# EAGLE design Front panel PCB (EAGLE 5.12)
AUTHORNAME: Aaron Bonnell-Kangas; BOARDNAME: Balancer Front Panel; BOM: EXCLUDE; DATABASE: ../../../../../Component libraries/partsdb.txt; DESC: CAN HEADER; FUNCTION: BALANCER BOARD COMM; PARTNO: BCX38C; QTY: 2; REVISIONDATE: v1.0 - 2016-01-xx

## Sheet 1 of 5
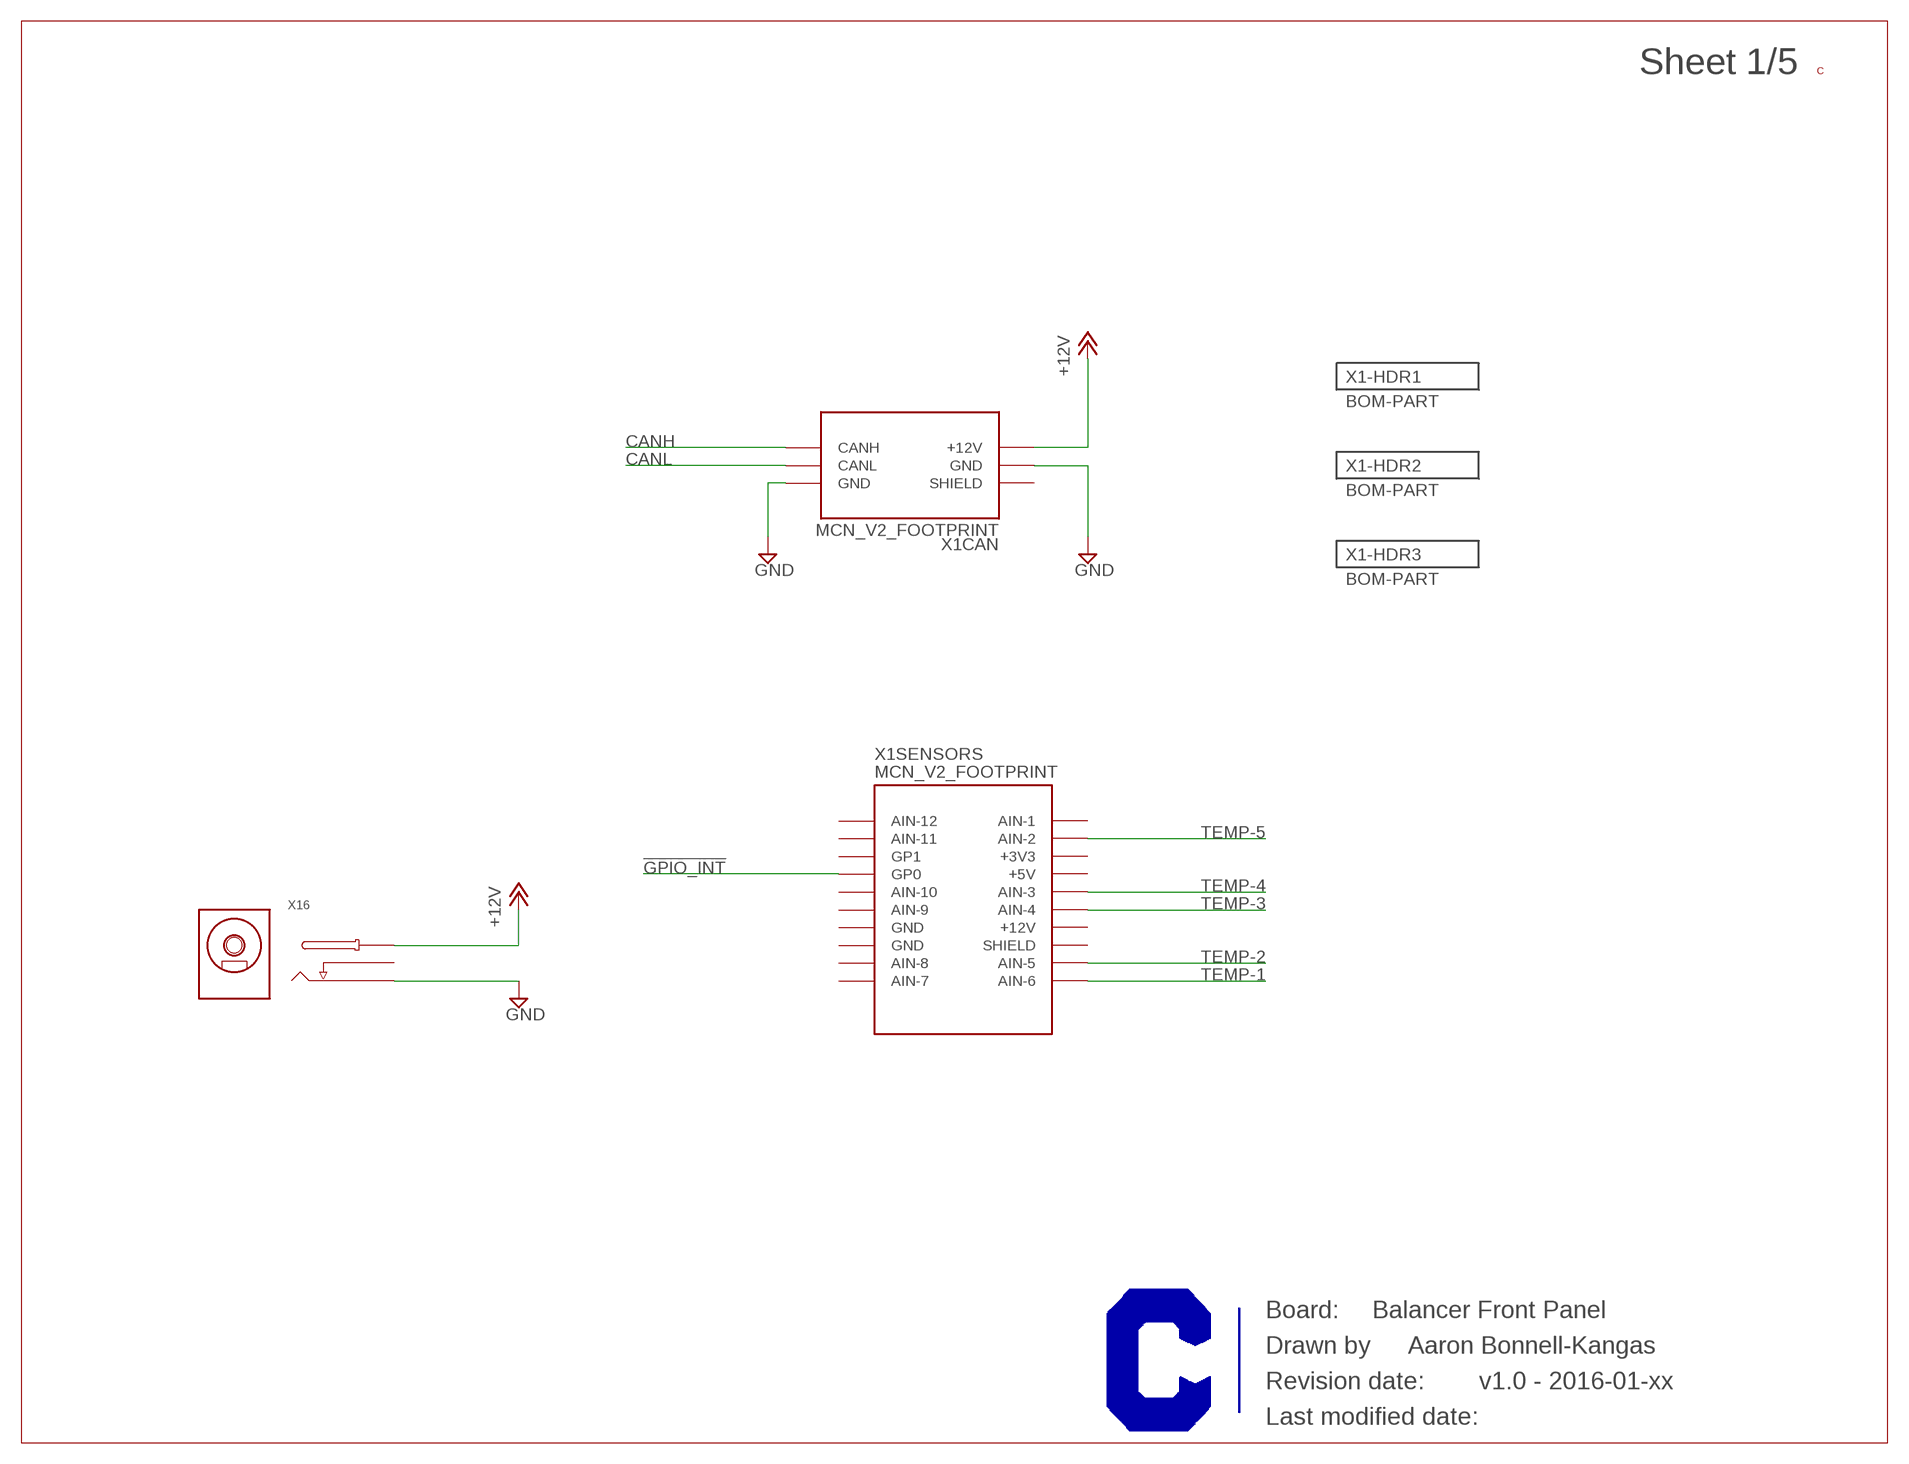
[diagram p0: schematic, sheet 1]
X1-HDR1 (BOM-PART): BOM: INCLUDE; QTY: 1
X1-HDR2 (BOM-PART): BOM: INCLUDE; QTY: 1
X1-HDR3 (BOM-PART): BOM: INCLUDE; QTY: 1

### Parts
U$6  CURRENT-LOGO-0.25"  [CURRENT-0.25"]
X1  MCN_V2_FOOTPRINT  [MCN_V2_FOOTPRINT]
X16  BARREL_JACK-NO_CUTOUTS  [BARREL_JACK_5.5X2.1_NO-CUTOUTS]

### Nets
!GPIO_INT: X1.SENSORS-7(SENSORS:GP0) ; also sheet 2
+12V: X1.CAN-5(CAN:+12V) X16.1(TIP) ; also sheet 3,5
CANH: X1.CAN-6(CAN:CANH) ; also sheet 3
CANL: X1.CAN-4(CAN:CANL) ; also sheet 3
GND: X1.CAN-2(CAN:GND) X1.CAN-3(CAN:GND) X16.2(SLEEVE) ; also sheet 2,3,4,5
TEMP-1: X1.SENSORS-12(SENSORS:AIN-6) ; also sheet 5
TEMP-2: X1.SENSORS-11(SENSORS:AIN-5) ; also sheet 5
TEMP-3: X1.SENSORS-15(SENSORS:AIN-4) ; also sheet 5
TEMP-4: X1.SENSORS-16(SENSORS:AIN-3) ; also sheet 5
TEMP-5: X1.SENSORS-19(SENSORS:AIN-2) ; also sheet 5
Unconnected: X1.CAN-1(CAN:SHIELD) X1.SENSORS-1(SENSORS:AIN-7) X1.SENSORS-2(SENSORS:AIN-8) X1.SENSORS-3(SENSORS:GND) X1.SENSORS-4(SENSORS:GND) X1.SENSORS-5(SENSORS:AIN-9) X1.SENSORS-6(SENSORS:AIN-10) X1.SENSORS-8(SENSORS:GP1) X1.SENSORS-9(SENSORS:AIN-11) X1.SENSORS-10(SENSORS:AIN-12) X1.SENSORS-13(SENSORS:SHIELD) X1.SENSORS-14(SENSORS:+12V) X1.SENSORS-17(SENSORS:+5V) X1.SENSORS-18(SENSORS:+3V3) X1.SENSORS-20(SENSORS:AIN-1) X16.3(BREAK)

## Sheet 2 of 5
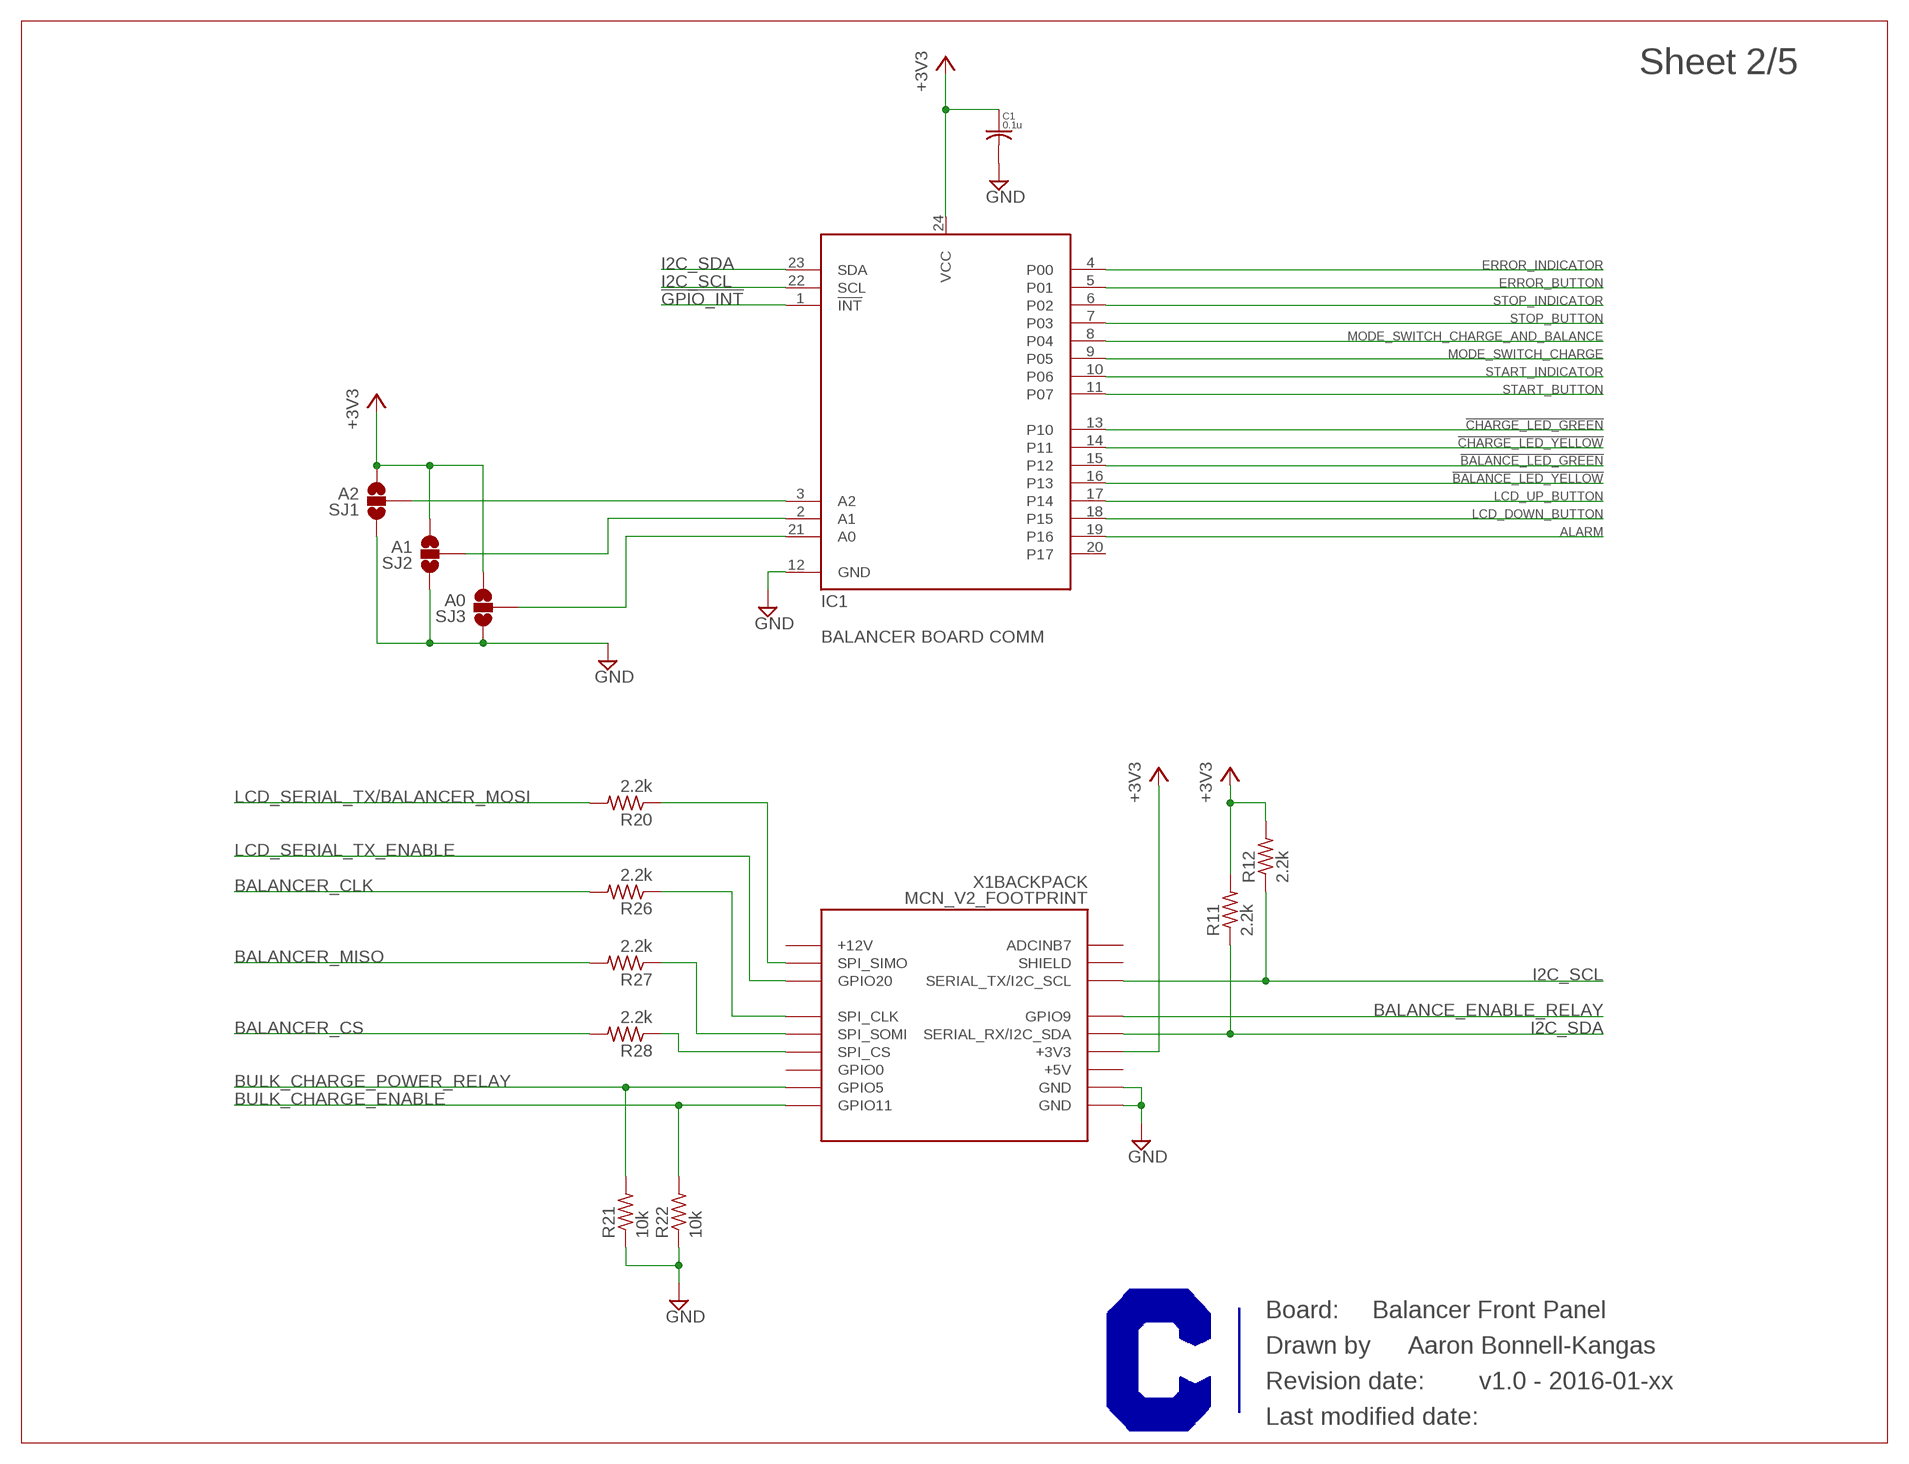
[diagram p1: schematic, sheet 2]

### Parts
C1  0.1u  C-USC0603  [C0603]
IC1  TCA9555PWR  [PW_(R-PDSO-G24)_(TSSOP-24)]
R11  2.2k  R-US_R0603  [R0603]
R12  2.2k  R-US_R0603  [R0603]
R20  2.2k  R-US_R0603  [R0603]
R21  10k  R-US_R0603  [R0603]
R22  10k  R-US_R0603  [R0603]
R26  2.2k  R-US_R0603  [R0603]
R27  2.2k  R-US_R0603  [R0603]
R28  2.2k  R-US_R0603  [R0603]
SJ1  A2  SOLDERJUMPER_2WAYPASTE1&2  [SJ_3_PASTE1&2]
SJ2  A1  SOLDERJUMPER_2WAYPASTE1&2  [SJ_3_PASTE1&2]
SJ3  A0  SOLDERJUMPER_2WAYPASTE1&2  [SJ_3_PASTE1&2]

### Nets
!BALANCE_LED_GREEN: IC1.15(P12) ; also sheet 4
!BALANCE_LED_YELLOW: IC1.16(P13) ; also sheet 4
!CHARGE_LED_GREEN: IC1.13(P10) ; also sheet 4
!CHARGE_LED_YELLOW: IC1.14(P11) ; also sheet 4
!GPIO_INT: IC1.1(!INT) ; also sheet 1
+3V3: C1.1 IC1.24(VCC) R11.2 R12.2 SJ1.3 SJ2.3 SJ3.3 X1.X1-7(BACKPACK:+3V3) ; also sheet 3,4,5
ALARM: IC1.19(P16) ; also sheet 5
BALANCE_ENABLE_RELAY: X1.X1-5(BACKPACK:GPIO9) ; also sheet 3
BALANCER_CLK: R26.2 ; also sheet 4
BALANCER_CS: R28.2 ; also sheet 4
BALANCER_MISO: R27.2 ; also sheet 4
BULK_CHARGE_ENABLE: R22.2 X1.X2-10(BACKPACK:GPIO11) ; also sheet 4
BULK_CHARGE_POWER_RELAY: R21.2 X1.X2-9(BACKPACK:GPIO5) ; also sheet 4
ERROR_BUTTON: IC1.5(P01) ; also sheet 3
ERROR_INDICATOR: IC1.4(P00) ; also sheet 3
GND: C1.2 IC1.12(GND) R21.1 R22.1 SJ1.1 SJ2.1 SJ3.1 X1.X1-9(BACKPACK:GND) X1.X1-10(BACKPACK:GND) ; also sheet 1,3,4,5
I2C_SCL: IC1.22(SCL) R12.1 X1.X1-3(BACKPACK:SERIAL_TX/I2C_SCL) ; also sheet 4
I2C_SDA: IC1.23(SDA) R11.1 X1.X1-6(BACKPACK:SERIAL_RX/I2C_SDA) ; also sheet 4
LCD_DOWN_BUTTON: IC1.18(P15) ; also sheet 4
LCD_SERIAL_TX/BALANCER_MOSI: R20.2 ; also sheet 4
LCD_SERIAL_TX_ENABLE: X1.X2-3(BACKPACK:GPIO20) ; also sheet 4
LCD_UP_BUTTON: IC1.17(P14) ; also sheet 4
MODE_SWITCH_CHARGE: IC1.9(P05) ; also sheet 3
MODE_SWITCH_CHARGE_AND_BALANCE: IC1.8(P04) ; also sheet 3
N$8: R20.1 X1.X2-2(BACKPACK:SPI_SIMO)
N$9: IC1.3(A2) SJ1.2
N$11: IC1.2(A1) SJ2.2
N$12: IC1.21(A0) SJ3.2
N$14: R26.1 X1.X2-5(BACKPACK:SPI_CLK)
N$17: R27.1 X1.X2-6(BACKPACK:SPI_SOMI)
N$18: R28.1 X1.X2-7(BACKPACK:SPI_CS)
START_BUTTON: IC1.11(P07) ; also sheet 3
START_INDICATOR: IC1.10(P06) ; also sheet 3
STOP_BUTTON: IC1.7(P03) ; also sheet 3
STOP_INDICATOR: IC1.6(P02) ; also sheet 3
Unconnected: IC1.20(P17) X1.X1-1(BACKPACK:ADCINB7) X1.X1-2(BACKPACK:SHIELD) X1.X1-8(BACKPACK:+5V) X1.X2-1(BACKPACK:+12V) X1.X2-8(BACKPACK:GPIO0)

## Sheet 3 of 5
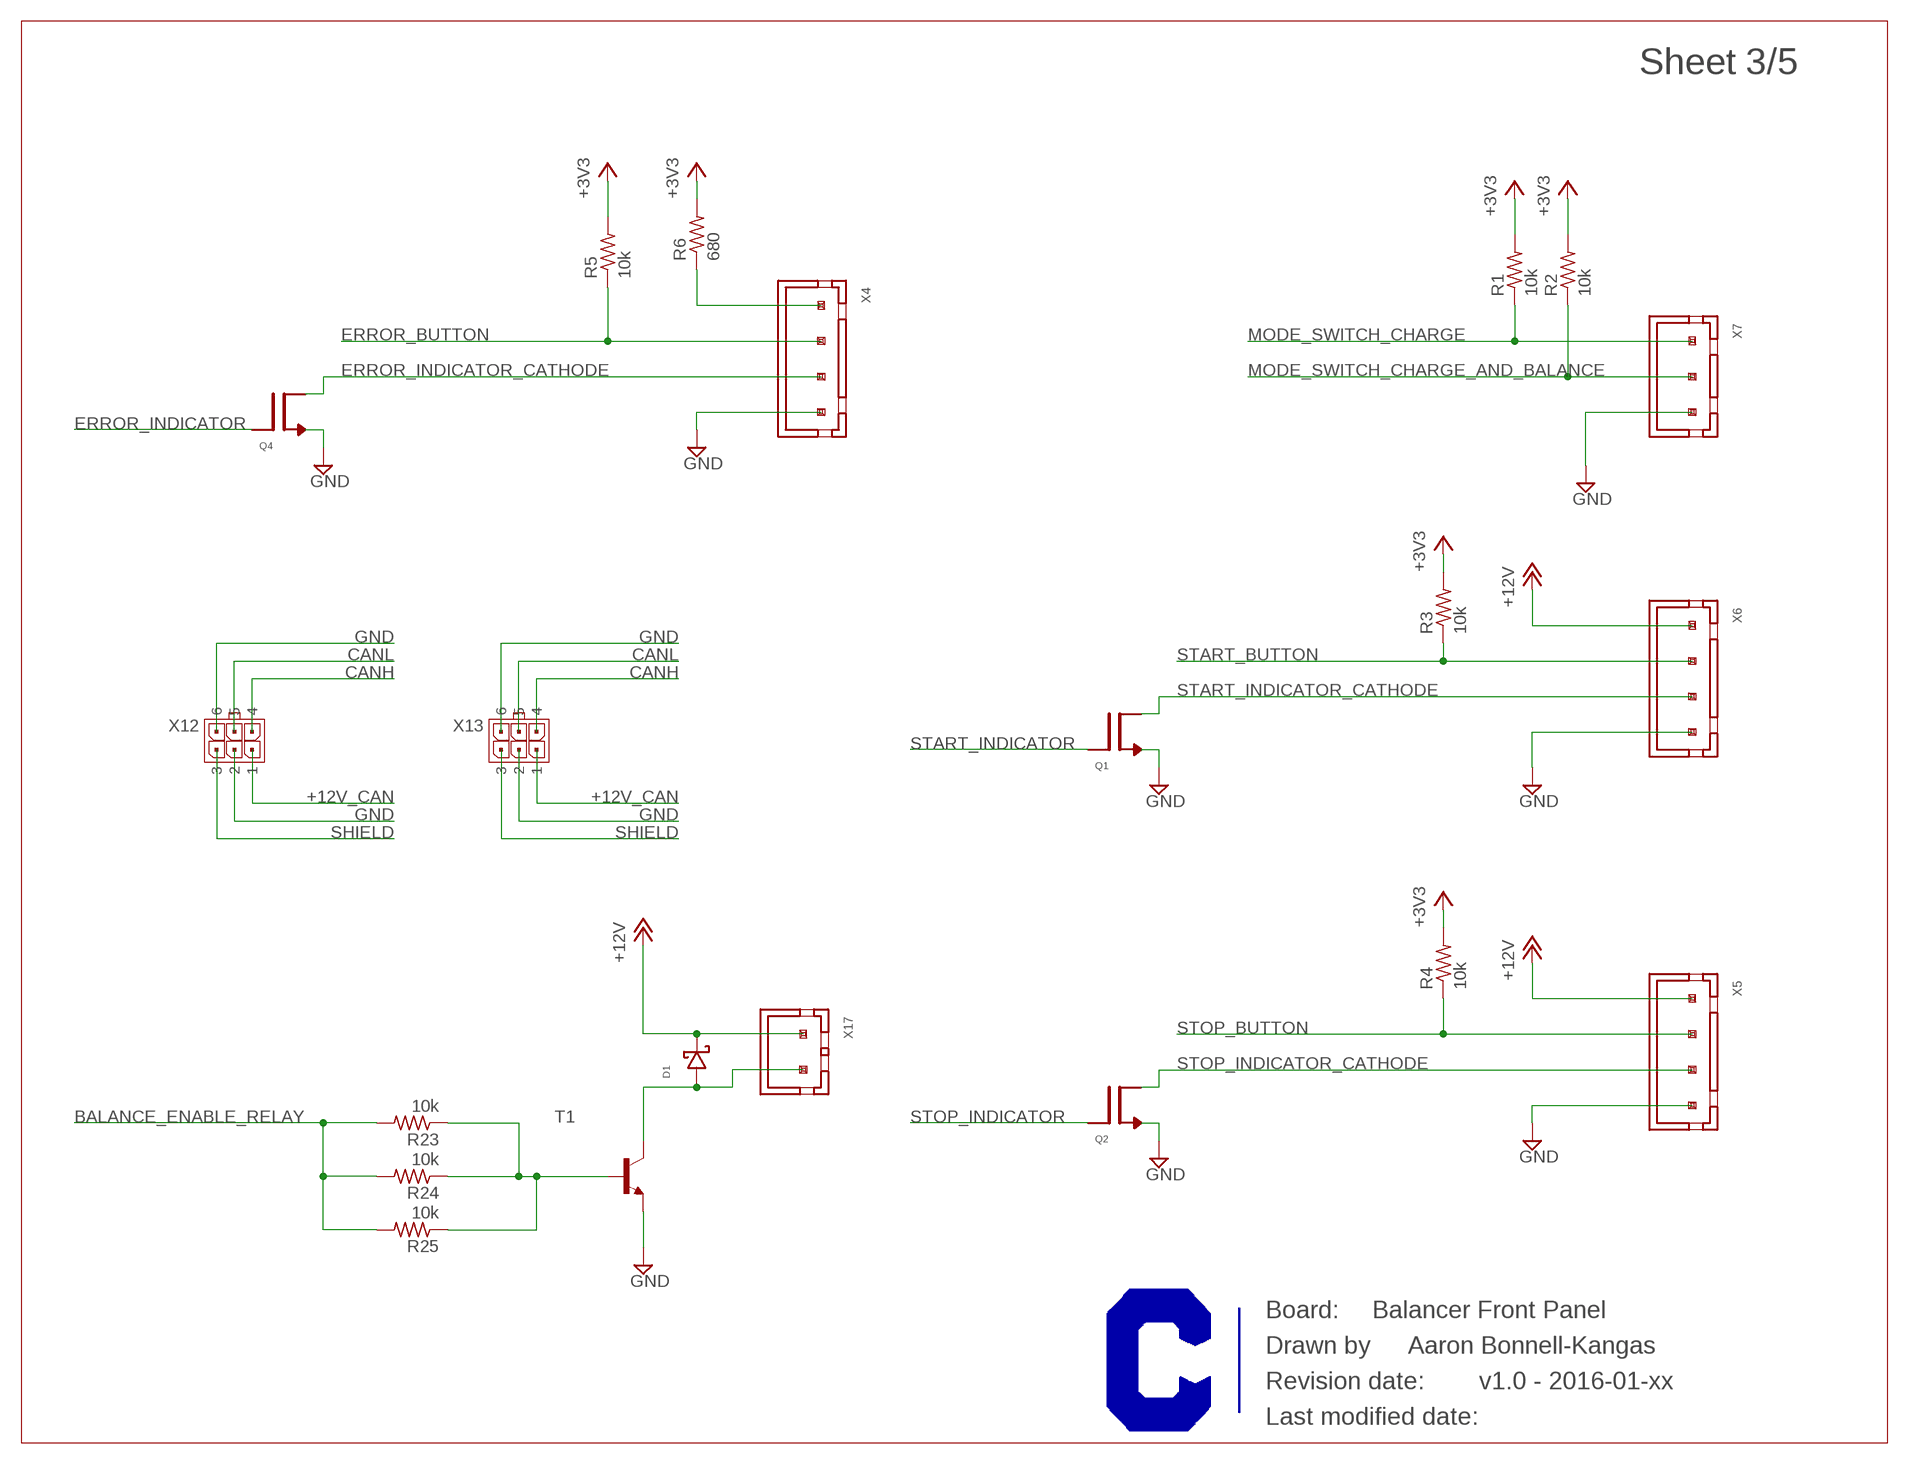
[diagram p2: schematic, sheet 3]

### Parts
D1  SCHOTTKY_DIODE-SMA  [SMA]
Q1  FDN359AN  [SOT-23]
Q2  FDN359AN  [SOT-23]
Q4  FDN359AN  [SOT-23]
R1  10k  R-US_R0603  [R0603]
R2  10k  R-US_R0603  [R0603]
R3  10k  R-US_R0603  [R0603]
R4  10k  R-US_R0603  [R0603]
R5  10k  R-US_R0603  [R0603]
R6  680  R-US_R1210  [R1210]
R23  10k  R-US_R0603  [R0603]
R24  10k  R-US_R0603  [R0603]
R25  10k  R-US_R0603  [R0603]
T1  MPS2222A-NPN-TO92-CBE  [TO92-CBE]
X4  XH-4CKT-VERT-THRU  [B4B-XH-A]
X5  XH-4CKT-VERT-THRU  [B4B-XH-A]
X6  XH-4CKT-VERT-THRU  [B4B-XH-A]
X7  XH-3CKT-VERT-THRU  [B3B-XH-A]
X12  MICROFIT-06-DUAL-GOLD-THRU-POLARIZING_PEG-VERT  [MICROFIT-6-VERT-THRU-POLARIZING_PEG]
X13  MICROFIT-06-DUAL-GOLD-THRU-POLARIZING_PEG-VERT  [MICROFIT-6-VERT-THRU-POLARIZING_PEG]
X17  XH-2CKT-VERT  [B2B-XH-A]

### Nets
+3V3: R1.2 R2.2 R3.2 R4.2 R5.2 R6.2 ; also sheet 2,4,5
+12V: D1.CATHODE X5.1 X6.1 X17.1 ; also sheet 1,5
+12V_CAN: X12.1 X13.1
BALANCE_ENABLE_RELAY: R23.2 R24.2 R25.2 ; also sheet 2
CANH: X12.4 X13.4 ; also sheet 1
CANL: X12.5 X13.5 ; also sheet 1
ERROR_BUTTON: R5.1 X4.2 ; also sheet 2
ERROR_INDICATOR: Q4.1(GATE) ; also sheet 2
ERROR_INDICATOR_CATHODE: Q4.3(DRAIN) X4.3
GND: Q1.2(SOURCE) Q2.2(SOURCE) Q4.2(SOURCE) T1.E X4.4 X5.4 X6.4 X7.3 X12.2 X12.6 X13.2 X13.6 ; also sheet 1,2,4,5
MODE_SWITCH_CHARGE: R1.1 X7.1 ; also sheet 2
MODE_SWITCH_CHARGE_AND_BALANCE: R2.1 X7.2 ; also sheet 2
N$1: R6.1 X4.1
N$15: D1.ANODE T1.C X17.2
N$16: R23.1 R24.1 R25.1 T1.B
SHIELD: X12.3 X13.3
START_BUTTON: R3.1 X6.2 ; also sheet 2
START_INDICATOR: Q1.1(GATE) ; also sheet 2
START_INDICATOR_CATHODE: Q1.3(DRAIN) X6.3
STOP_BUTTON: R4.1 X5.2 ; also sheet 2
STOP_INDICATOR: Q2.1(GATE) ; also sheet 2
STOP_INDICATOR_CATHODE: Q2.3(DRAIN) X5.3

## Sheet 4 of 5
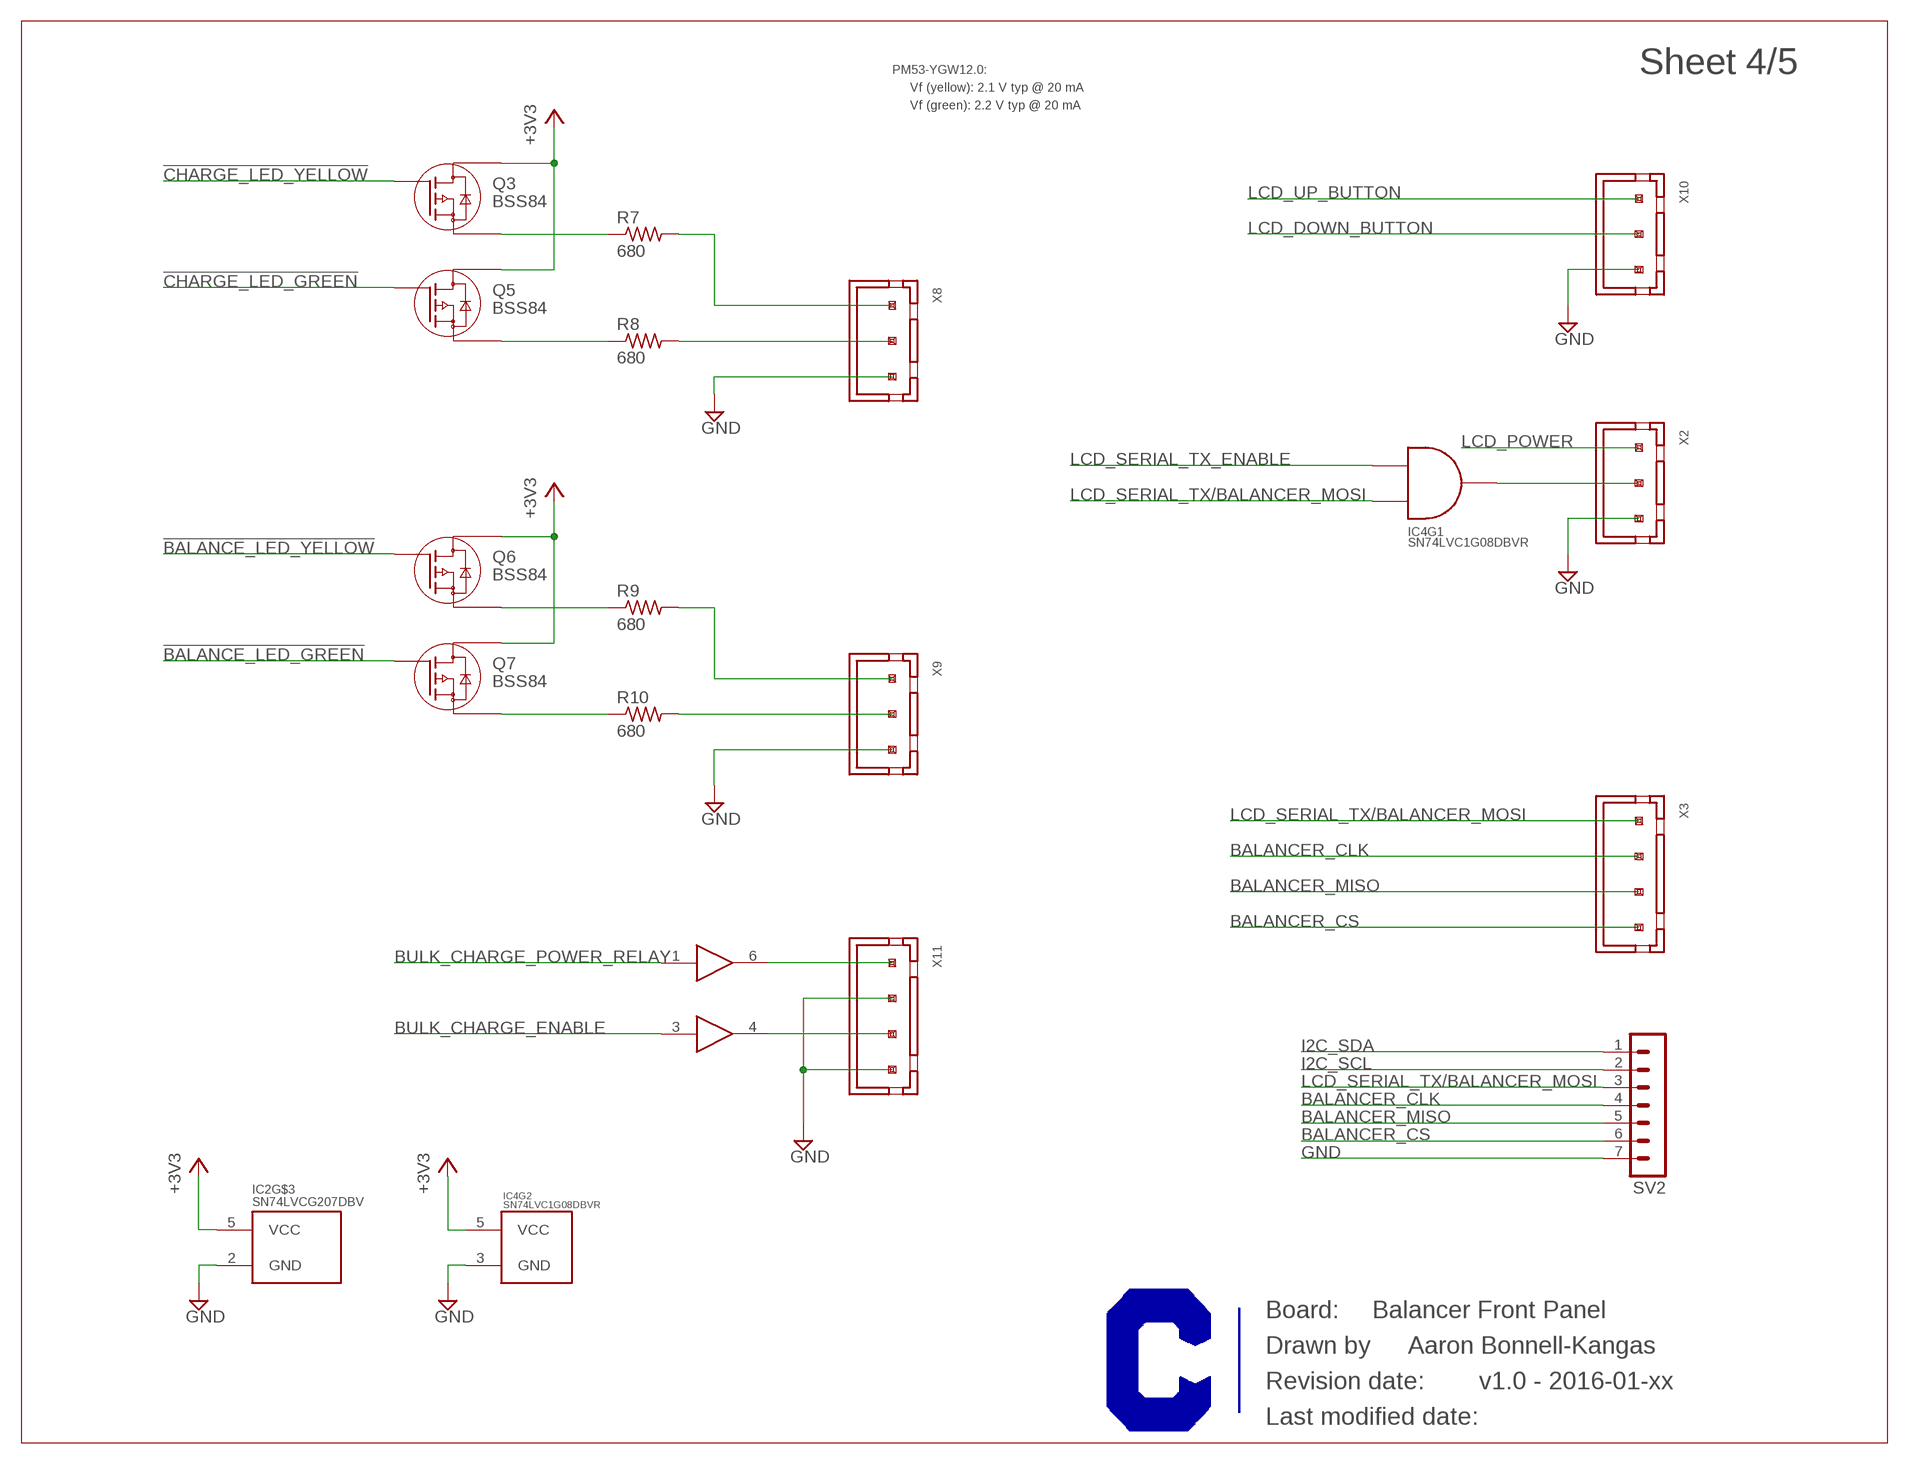
[diagram p3: schematic, sheet 4]

### Parts
IC2  SN74LVCG207DBV  [DBV_(R-PDSO-G6)]
IC4  SN74LVC1G08DBVR  [SOT-23-5_(DBV-R-PDSO-G5)]
Q3  BSS84  [SOT-23]
Q5  BSS84  [SOT-23]
Q6  BSS84  [SOT-23]
Q7  BSS84  [SOT-23]
R7  680  R-US_R1210  [R1210]
R8  680  R-US_R1210  [R1210]
R9  680  R-US_R1210  [R1210]
R10  680  R-US_R1210  [R1210]
SV2  MA07-1  [MA07-1]
X2  XH-3CKT-VERT-THRU  [B3B-XH-A]
X3  XH-4CKT-VERT-THRU  [B4B-XH-A]
X8  XH-3CKT-VERT-THRU  [B3B-XH-A]
X9  XH-3CKT-VERT-THRU  [B3B-XH-A]
X10  XH-3CKT-VERT-THRU  [B3B-XH-A]
X11  XH-4CKT-VERT-THRU  [B4B-XH-A]

### Nets
!BALANCE_LED_GREEN: Q7.1(GATE) ; also sheet 2
!BALANCE_LED_YELLOW: Q6.1(GATE) ; also sheet 2
!CHARGE_LED_GREEN: Q5.1(GATE) ; also sheet 2
!CHARGE_LED_YELLOW: Q3.1(GATE) ; also sheet 2
+3V3: IC2.5(VCC) IC4.5(VCC) Q3.2(SOURCE) Q5.2(SOURCE) Q6.2(SOURCE) Q7.2(SOURCE) ; also sheet 2,3,5
BALANCE_LED_GREEN_CATHODE1: R10.2 X9.2
BALANCE_LED_YELLOW_CATHODE1: R9.2 X9.1
BALANCER_CLK: SV2.4 X3.2 ; also sheet 2
BALANCER_CS: SV2.6 X3.4 ; also sheet 2
BALANCER_MISO: SV2.5 X3.3 ; also sheet 2
BULK_CHARGE_ENABLE: IC2.3(A) ; also sheet 2
BULK_CHARGE_ENABLE_BUFFERED: IC2.4(Y) X11.3
BULK_CHARGE_POWER_RELAY: IC2.1(A) ; also sheet 2
BULK_CHARGER_POWER_RELAY_BUFFERED: IC2.6(Y) X11.1
CHARGE_LED_YELLOW_CATHODE: R7.2 X8.1
GND: IC2.2(GND) IC4.3(GND) SV2.7 X2.3 X8.3 X9.3 X10.3 X11.2 X11.4 ; also sheet 1,2,3,5
I2C_SCL: SV2.2 ; also sheet 2
I2C_SDA: SV2.1 ; also sheet 2
LCD_DOWN_BUTTON: X10.2 ; also sheet 2
LCD_POWER: X2.1 ; also sheet 5
LCD_SERIAL_TX/BALANCER_MOSI: IC4.2(B) SV2.3 X3.1 ; also sheet 2
LCD_SERIAL_TX_ENABLE: IC4.1(A) ; also sheet 2
LCD_UP_BUTTON: X10.1 ; also sheet 2
N$2: Q3.3(DRAIN) R7.1
N$3: Q5.3(DRAIN) R8.1
N$4: Q6.3(DRAIN) R9.1
N$5: Q7.3(DRAIN) R10.1
N$6: R8.2 X8.2
N$13: IC4.4(Y) X2.2

### Notes on the sheet
- PM53-YGW12.0:
- Vf (yellow): 2.1 V typ @ 20 mA
- Vf (green): 2.2 V typ @ 20 mA

## Sheet 5 of 5
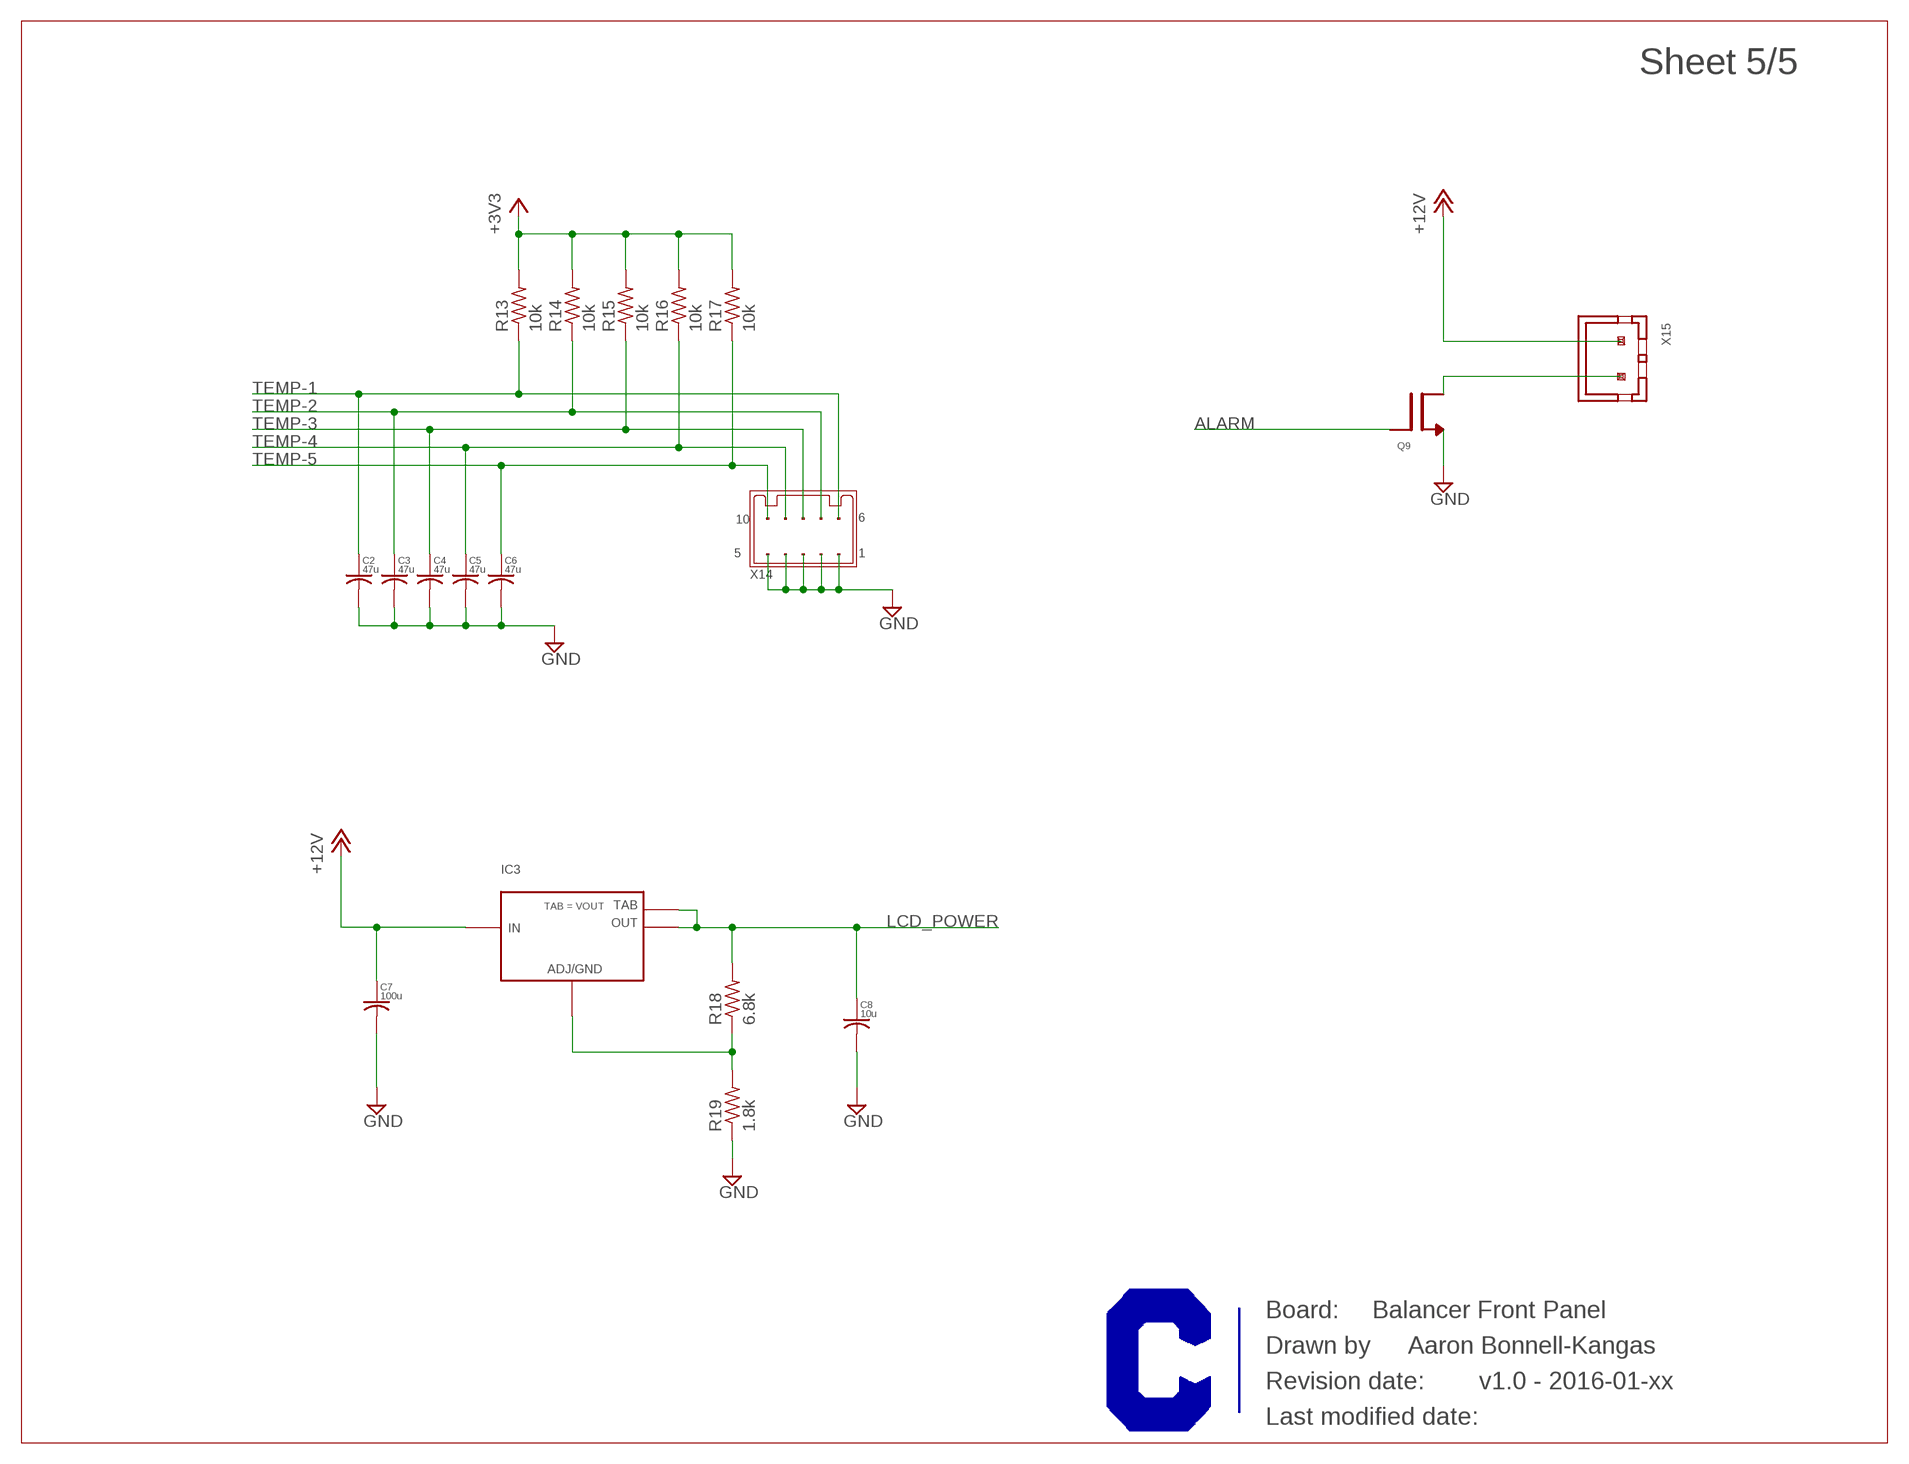
[diagram p4: schematic, sheet 5]

### Parts
C2  47u  C-USC1206  [C1206]
C3  47u  C-USC1206  [C1206]
C4  47u  C-USC1206  [C1206]
C5  47u  C-USC1206  [C1206]
C6  47u  C-USC1206  [C1206]
C7  100u  C-USC1812  [C1812]
C8  10u  C-USC3216  [C3216]
IC3  LM1117MP-ADJ/NOPB  [DCY_(R-PDSO-G4)]
Q9  FDN359AN  [SOT-23]
R13  10k  R-US_R0603  [R0603]
R14  10k  R-US_R0603  [R0603]
R15  10k  R-US_R0603  [R0603]
R16  10k  R-US_R0603  [R0603]
R17  10k  R-US_R0603  [R0603]
R18  6.8k  R-US_R0603  [R0603]
R19  1.8k  R-US_R0603  [R0603]
X14  MICROCLASP-10-DUAL-VERT  [MICROCLASP-10-DUAL-VERT]
X15  XH-2CKT-RA  [S2B-XH-A]

### Nets
+3V3: R13.2 R14.2 R15.2 R16.2 R17.2 ; also sheet 2,3,4
+12V: C7.1 IC3.3(IN) X15.1 ; also sheet 1,3
ALARM: Q9.1(GATE) ; also sheet 2
GND: C2.2 C3.2 C4.2 C5.2 C6.2 C7.2 C8.2 Q9.2(SOURCE) R19.1 X14.1 X14.2 X14.3 X14.4 X14.5 ; also sheet 1,2,3,4
LCD_POWER: C8.1 IC3.2(OUT) IC3.4(TAB) R18.2 ; also sheet 4
N$7: Q9.3(DRAIN) X15.2
N$10: IC3.1(GND) R18.1 R19.2
TEMP-1: C2.1 R13.1 X14.6 ; also sheet 1
TEMP-2: C3.1 R14.1 X14.7 ; also sheet 1
TEMP-3: C4.1 R15.1 X14.8 ; also sheet 1
TEMP-4: C5.1 R16.1 X14.9 ; also sheet 1
TEMP-5: C6.1 R17.1 X14.10 ; also sheet 1

## Library data of the parts
C1-C8 = rcl:C-US: CAPACITOR, American symbol
D1 = Diodes:SCHOTTKY_DIODE
IC1 = TI:TCA9555: TCA9555 - 16-bit Low-Voltage I2C and SMBus I/O Expander with Interrupt Output and Configuration Registers Datasheet: http://www.ti.com/lit/ds/symlink/tca9555.pdf; PARTNO: TCA9555PWR
IC2 = TI:SN74LVCG207: SN74LVC2G07: Dual Buffer/Driver with Open Drain Outputs no datasheet 4 u!!
IC3 = TI:LM1117: LM1117 - Adjustable LDO voltage regulator, 1.25V to 13.8V Product page: http://www.ti.com/product/lm1117; PARTNO: LM1117MP-ADJ/NOPB
IC4 = TI:SN74LVC1G08: SN74LVC1G08: Single 2-Input Positive-AND Gate Datasheet: http://www.ti.com/lit/ds/symlink/sn74lvc1g08.pdf; PARTNO: SN74LVC1G08DBVR
Q1 Q2 Q4 Q9 = Fairchild Semiconductor:FDN359AN: FDN359AN - N-Channel Logic Level PowerTrench MOSFET Datasheet: http://datasheet.octopart.com/FDN359AN-Fairchild-datasheet-83786.pdf
Q3 Q5-Q7 = Fairchild Semiconductor:BSS84: P-Channel Enhancement Mode Field-Effect Transistor, -0.13 A, -50 V, SOT-23 Datasheet: http://datasheet.octopart.com/BSS84-Fairchild-Semiconductor-datasheet-15983362.pdf; PARTNO: BSS84
R1-R28 = rcl:R-US_: RESISTOR, American symbol
SJ1-SJ3 = SparkFun:SOLDERJUMPER_2WAY: Solder Jumper 2 way solder jumper
SV2 = con-lstb:MA07-1: PIN HEADER; OC_FARNELL: unknown; OC_NEWARK: unknown
T1 = transistor:*-NPN-: NPN Transistror BF959 corrected 2008.03.06
U$6 = Logos:CURRENT-LOGO; BOM: EXCLUDE
X1 = Buckeye Current:MCN_V2_FOOTPRINT: Magic CAN Node v2 footprint This is the footprint you should use for board-to-board interfacing of a Magic CAN Node v2.2+. You will need the following connectors: Connector MCN part Mating part CAN connector Harwin M22-714032 (female) Harwin M22-2020305 (male) Sensor connector 2x Harwin M22-7131042 (female) 2x Harwin M22-2511005 (male) Backpack headers 2x Sullins LPPB101NFFN-RC (female) 2x Sullins GRPB101VWVN-RC (male) The minimum board-to-board clearance is 5.9 mm. You can use a 6mm standoff and it will work OK. -abk, Jan. 2016
X2 X7-X10 = JST:XH-3CKT: XH connector, 3 circuits Datasheet: http://www.jst-mfg.com/product/pdf/eng/eXH.pdf Mating connector: XHP-3 Terminals: SXH-001T-P0.6 (28-22awg) SXH-002T-P0.6 (30-26awg); PARTNO: B3B-XH-A
X3-X6 X11 = JST:XH-4CKT: XH connector, 4 circuits Datasheet: http://www.jst-mfg.com/product/pdf/eng/eXH.pdf; PARTNO: B4B-XH-A
X12 X13 = Molex:MICROFIT-06-DUAL: Molex MicroFit 3.00mm Pitch Header, Surface Mount, Dual Row, 6 Circuits Note, November 2014: These come in three styles: Through-hole, with metal clip retention to PCB (not currently represented) (cheapest) SMD, with solder tab retention (-SMD) (more expensive, commonly stocked) SMD, with metal clip retention (-SMD-CLIP_RETENTION) (most expensive, not often stocked) Please use them in that order! Drawing: http://www.molex.com/pdm_docs/sd/430450609_sd.pdf (right-angle) Information: http://www.molex.com/molex/products/datasheet.jsp?part=active/0430450618_PCB_HEADERS.xml; PARTNO: 43045-0613
X14 = Molex:MICROCLASP-10-DUAL: Microclasp 10 crkt Header Datasheet <http://www.molex.com/pdm_docs/sd/559591030_sd.pdf>; PARTNO: 55917-1010
X15 = JST:XH-2CKT: XH connector, 2 circuits Datasheet: http://www.jst-mfg.com/product/pdf/eng/eXH.pdf Mating connector: XHP-2 Terminals: SXH-001T-P0.6 (28-22awg) SXH-002T-P0.6 (30-26awg); PARTNO: S2B-XH-A
X16 = Generic connectors:BARREL_JACK: DC power jack, cylindrical, barrel style This is a common type of input power connector.; PARTNO: PJ-002A
X17 = JST:XH-2CKT: XH connector, 2 circuits Datasheet: http://www.jst-mfg.com/product/pdf/eng/eXH.pdf Mating connector: XHP-2 Terminals: SXH-001T-P0.6 (28-22awg) SXH-002T-P0.6 (30-26awg); PARTNO: B2B-XH-A

## Board
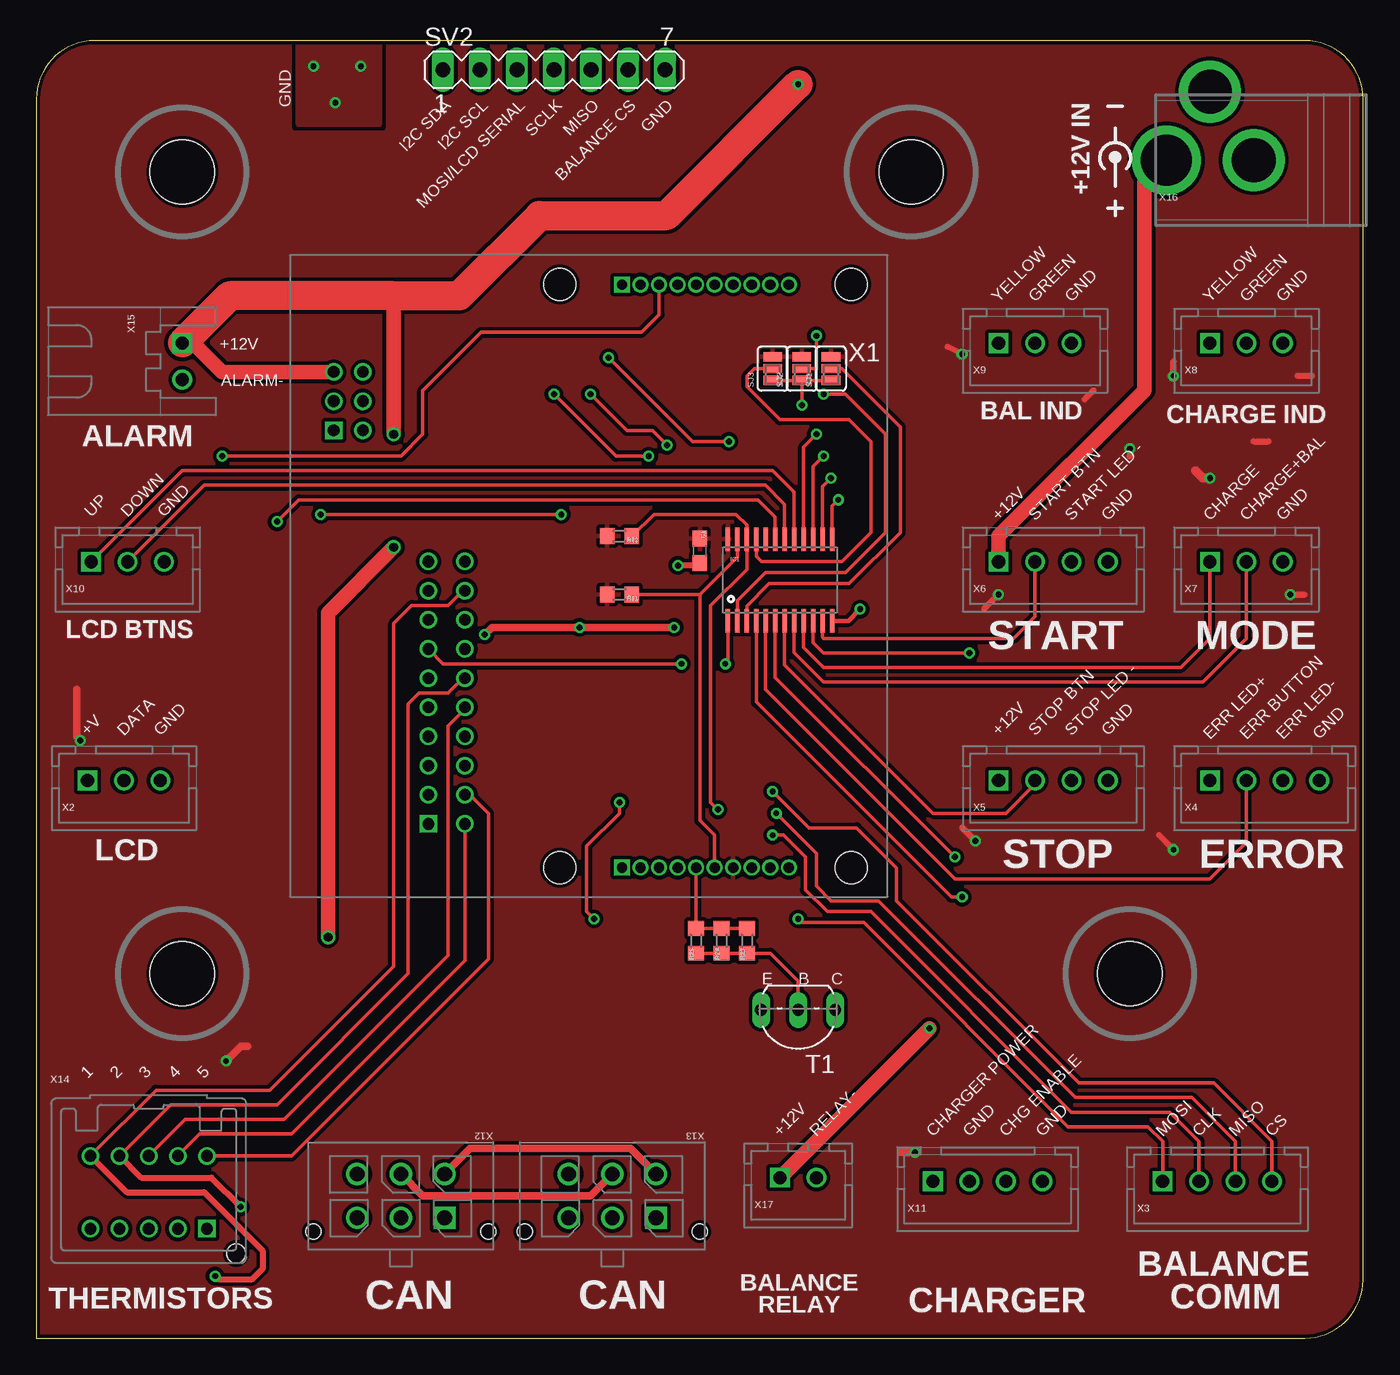
[diagram p5: board, top side]
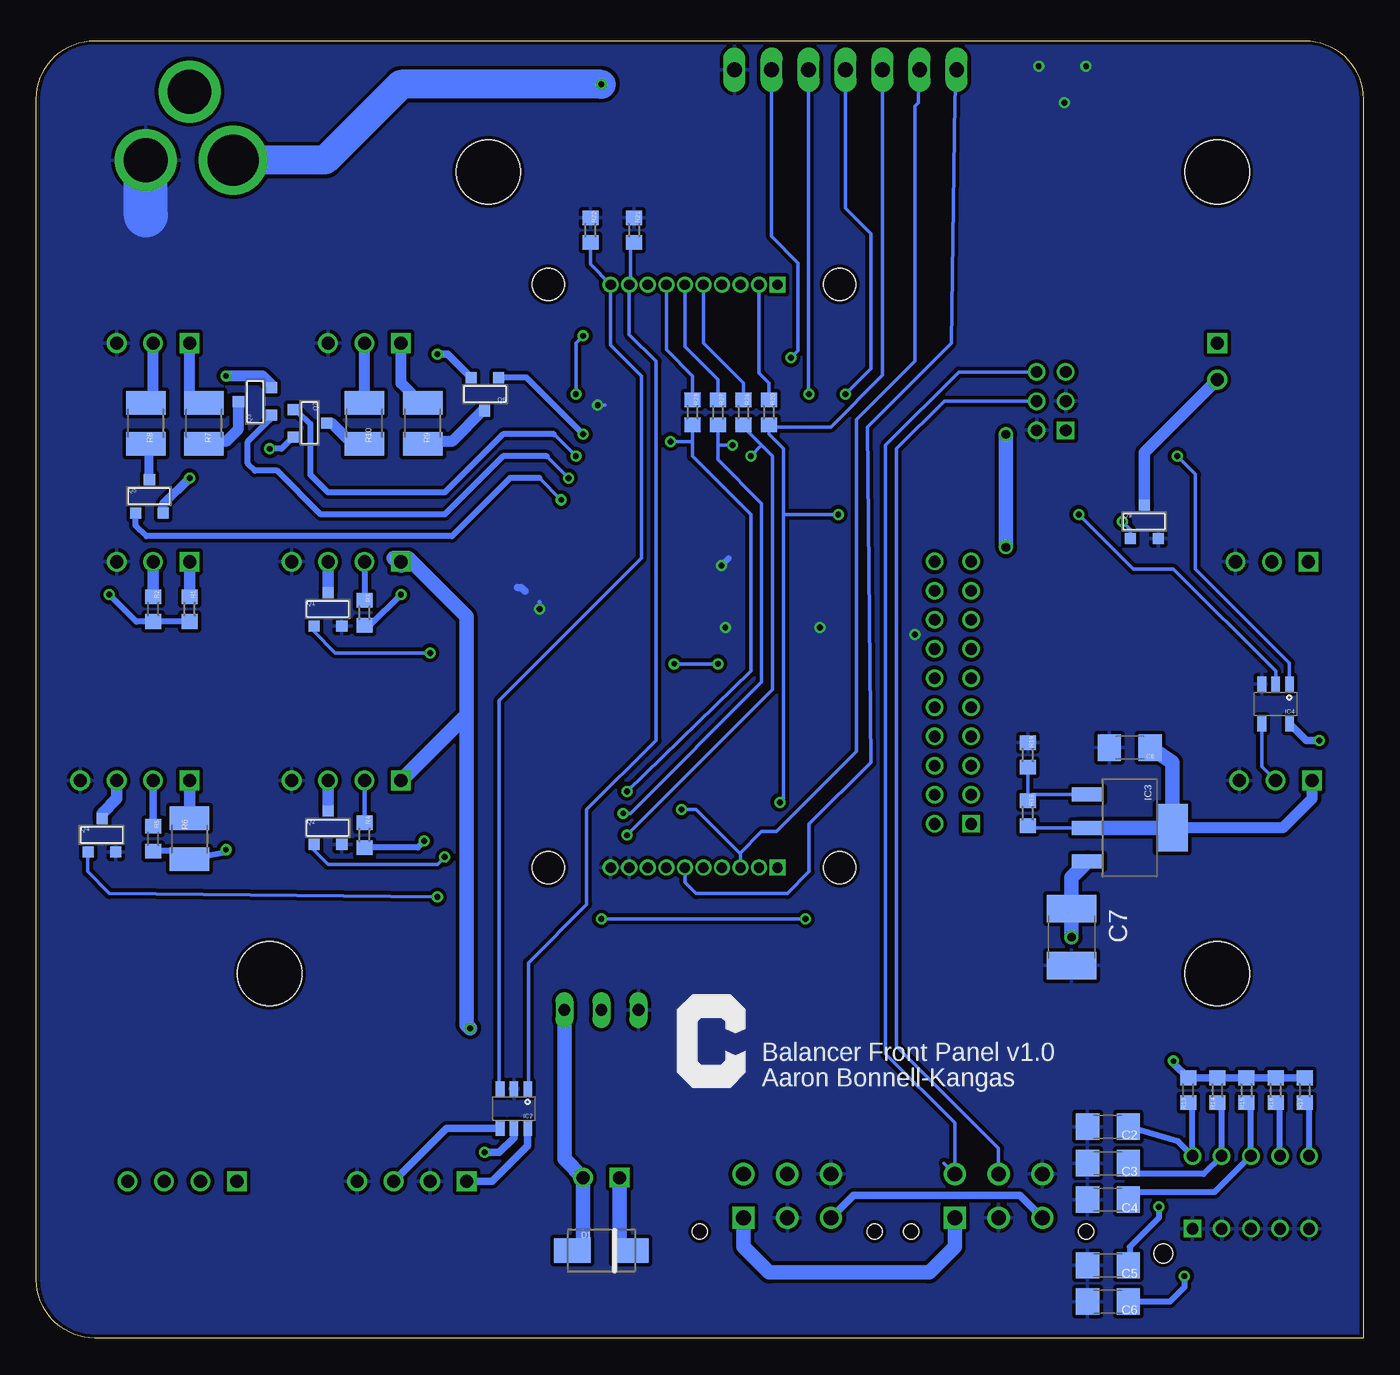
[diagram p6: board, bottom side, seen from below]

Size 91 x 89 mm. Coordinates in mm from the lower left corner, seen from the top.
Outline: 0,0 87,0 arc90 91,4 91,85 arc90 87,89 4,89 arc90 0,85 0,0
Copper layers (1*16): Top 0.0356mm / dielectric 1.5011mm / Bottom 0.0356mm
Design rules "OSH Park 2-layer *": minimum track width 6mil, minimum drill 13mil, track to track 7mil, track to pad 7mil, pad to pad 7mil, via to via 7mil, smd to smd 6mil, copper to edge 10mil, drill to drill 6mil, minimum pad ring 7mil, minimum via ring 7mil, stop-mask expansion 4mil, vias tented up to drill 25mil, thermal gap 10mil
Holes 4.4 mm at 10,25 75,25 10,80 60,80

### Footprints (pad centres in the part's own frame; a part is rotated, then mirrored left to right if it is on the bottom)
C0603 = smd 1.1 x 1: 1 -0.85,0; 2 0.85,0
C1206 = smd 1.6 x 1.8: 1 -1.4,0; 2 1.4,0
C1812 = smd 1.9 x 3.4: 1 -1.95,0; 2 1.95,0
C3216 = smd 1.6 x 1.8: 1 -1.4,0; 2 1.4,0
SMA = smd 2.5 x 1.7: ANODE -2,0; CATHODE 2,0
PW_(R-PDSO-G24)_(TSSOP-24) = smd 0.3 x 1.6: 1 -3.575,-2.8; 2 -2.925,-2.8; 3 -2.275,-2.8; 4 -1.625,-2.8; 5 -0.975,-2.8; 6 -0.325,-2.8; 7 0.325,-2.8; 8 0.975,-2.8; 9 1.625,-2.8; 10 2.275,-2.8; 11 2.925,-2.8; 12 3.575,-2.8; 13 3.575,2.8; 14 2.925,2.8; 15 2.275,2.8; 16 1.625,2.8; 17 0.975,2.8; 18 0.325,2.8; 19 -0.325,2.8; 20 -0.975,2.8; 21 -1.625,2.8; 22 -2.275,2.8; 23 -2.925,2.8; 24 -3.575,2.8
DBV_(R-PDSO-G6) = smd 0.6 x 1.05: 1 -0.95,-1.35; 2 0,-1.35; 3 0.95,-1.35; 4 0.95,1.35; 5 0,1.35; 6 -0.95,1.35
DCY_(R-PDSO-G4) = smd 0.95 x 2.15: 1 -2.3,-2.9; 2 0,-2.9; 3 2.3,-2.9 | smd 3.25 x 2.15: 4 0,2.9
SOT-23-5_(DBV-R-PDSO-G5) = smd 0.6 x 1.05: 1 -0.95,-1.35; 2 0,-1.35; 3 0.95,-1.35; 4 0.95,1.35; 5 -0.95,1.35
SOT-23 = smd 0.76 x 0.76: 1 -0.95,-1.145; 2 0.95,-1.145; 3 0,1.145
R0603 = smd 1 x 1.1: 1 -0.85,0; 2 0.85,0
R1210 = smd 1.6 x 2.7: 1 -1.4,0; 2 1.4,0
SJ_3_PASTE1&2 = smd 0.635 x 1.27: 1 -0.813,0; 2 0,0; 3 0.813,0
MA07-1 = drill 1.016 long: 1 -7.62,0; 2 -5.08,0; 3 -2.54,0; 4 0,0; 5 2.54,0; 6 5.08,0; 7 7.62,0
TO92-CBE = drill 0.813 long: B 0,0; C -2.54,0; E 2.54,0
MCN_V2_FOOTPRINT = drill 0.8 square: CAN-1 3,32; SENSORS-1 9.5,5 | drill 0.8 round: CAN-2 5,32; CAN-3 3,34; CAN-4 5,34; CAN-5 3,36; CAN-6 5,36; SENSORS-2 9.5,7; SENSORS-3 9.5,9; SENSORS-4 9.5,11; SENSORS-5 9.5,13; SENSORS-6 9.5,15; SENSORS-7 9.5,17; SENSORS-8 9.5,19; SENSORS-9 9.5,21; SENSORS-10 9.5,23; SENSORS-11 12,5; SENSORS-12 12,7; SENSORS-13 12,9; SENSORS-14 12,11; SENSORS-15 12,13; SENSORS-16 12,15; SENSORS-17 12,17; SENSORS-18 12,19; SENSORS-19 12,21; SENSORS-20 12,23 | drill 0.7 pad 1.1 square: X1-1 22.785,2; X2-1 22.785,42 | drill 0.7 pad 1.1 round: X1-2 24.055,2; X1-3 25.325,2; X1-4 26.595,2; X1-5 27.865,2; X1-6 29.135,2; X1-7 30.405,2; X1-8 31.675,2; X1-9 32.945,2; X1-10 34.215,2; X2-2 24.055,42; X2-3 25.325,42; X2-4 26.595,42; X2-5 27.865,42; X2-6 29.135,42; X2-7 30.405,42; X2-8 31.675,42; X2-9 32.945,42; X2-10 34.215,42 | hole 2.2: 18.5,2; 18.5,42; 38.5,42; 38.5,2
B3B-XH-A = drill 0.9 square: 1 -2.5,0 | drill 0.9 round: 2 0,0; 3 2.5,0
B4B-XH-A = drill 0.9 square: 1 -3.75,0 | drill 0.9 round: 2 -1.25,0; 3 1.25,0; 4 3.75,0
MICROFIT-6-VERT-THRU-POLARIZING_PEG = drill 1.02 square: 1 3,-1.5 | drill 1.02 round: 2 0,-1.5; 3 -3,-1.5; 4 3,1.5; 5 0,1.5; 6 -3,1.5 | hole 1.02: -6,-2.44; 6,-2.44
MICROCLASP-10-DUAL-VERT = drill 0.8 square: 1 4,-2.5 | drill 0.8 round: 2 2,-2.5; 3 0,-2.5; 4 -2,-2.5; 5 -4,-2.5; 6 4,2.5; 7 2,2.5; 8 0,2.5; 9 -2,2.5; 10 -4,2.5 | hole 1.3: 6,-4.2
S2B-XH-A = drill 0.9 square: 1 -1.25,0 | drill 0.9 round: 2 1.25,0
BARREL_JACK_5.5X2.1_NO-CUTOUTS = drill 3.5 pad 4.75 round: 1 -3,-4.7 | drill 3 pad 4.25 round: 2 3,-4.7; 3 0,0
B2B-XH-A = drill 0.9 square: 1 -1.25,0 | drill 0.9 round: 2 1.25,0

### Placement (x,y rotation side)
C1  45.5,54 270 top
C2  17.5,14.5 180 bottom
C3  17.5,12 180 bottom
C4  17.5,9.5 180 bottom
C5  17.5,5 180 bottom
C6  17.5,2.5 180 bottom
C7  20,27.5 270 bottom
C8  16,40.5 180 bottom
D1  52.25,6 0 bottom
IC1  51,52 0 top
IC2  58.25,15.75 180 bottom
IC3  16,35 270 bottom
IC4  6,43.5 180 bottom
Q1  71,50 0 bottom
Q2  71,35 0 bottom
Q3  76,64.25 90 bottom
Q4  86.5,34.5 0 bottom
Q5  83.25,57.75 0 bottom
Q6  60.25,64.75 180 bottom
Q7  72.25,62.75 270 bottom
Q9  15,56 0 bottom
R1  80.5,50 270 bottom
R2  83,50 270 bottom
R3  68.5,49.75 270 bottom
R4  68.5,34.5 270 bottom
R5  83,34.25 270 bottom
R6  80.5,34.25 270 bottom
R7  79.5,62.75 90 bottom
R8  83.5,62.75 90 bottom
R9  64.5,62.75 90 bottom
R10  68.5,62.75 90 bottom
R11  40,51 180 top
R12  40,55 180 top
R13  12,17 90 bottom
R14  10,17 90 bottom
R15  8,17 90 bottom
R16  6,17 90 bottom
R17  4,17 90 bottom
R18  23,36 270 bottom
R19  23,40 270 bottom
R20  40.75,63.5 270 bottom
R21  50,76 270 bottom
R22  53,76 270 bottom
R23  48.75,27.25 90 top
R24  47,27.25 90 top
R25  45.25,27.25 90 top
R26  42.5,63.5 270 bottom
R27  44.25,63.5 270 bottom
R28  46,63.5 270 bottom
SJ1  54.5,66.5 90 top
SJ2  52.5,66.5 90 top
SJ3  50.5,66.5 90 top
SV2  35.5,87 0 top
T1  52.25,22.5 180 top
U$6  47,17.25 0 bottom
X1  17.39,30.27 0 top
X2  6,38.25 0 top
X3  81,10.75 0 top
X4  84.25,38.25 0 top
X5  69.75,38.25 0 top
X6  69.75,53.25 0 top
X7  83,53.25 0 top
X8  83,68.25 0 top
X9  68.5,68.25 0 top
X10  6.25,53.25 0 top
X11  65.25,10.75 0 top
X12  25,9.75 0 top
X13  39.5,9.75 0 top
X14  7.7,10 0 top
X15  10,67 270 top
X16  80.5,85.5 0 top
X17  52.25,11 0 top

### Tracks (layer width: path | path; a pad name or v marks a point on that pad's centre or on a via)
!BALANCE_LED_GREEN  (via drill 0.4)
  Top 0.25: IC1.15 53.27,59.77 v54,60.5
  Bottom 0.25: v54,60.5 55.5,62 | 73.34,63.56 Q7.1
  Bottom 0.4: 55.5,62 59,62 63,58 71,58 72.2,59.2 72.2,62.7 73,63.5 73.28,63.5 73.34,63.56
!BALANCE_LED_YELLOW  (via drill 0.4)
  Top 0.25: IC1.16 52.62,61.12 v53.5,62
  Bottom 0.4: v53.5,62 57.4,65.89 Q6.1
!CHARGE_LED_GREEN  (via drill 0.4)
  Top 0.25: IC1.13 54.58,57.08 v55,57.5
  Bottom 0.25: v55,57.5 56.5,59
  Bottom 0.4: 56.5,59 58.5,59 62.5,55 83.45,55 84.2,55.75 Q5.1
!CHARGE_LED_YELLOW  (via drill 0.4)
  Top 0.25: IC1.14 53.92,58.42 v54.5,59
  Bottom 0.25: v54.5,59 56,60.5
  Bottom 0.4: 56,60.5 59,60.5 63,56.5 71.5,56.5 74.5,59.5 76,59.5 76.5,60 76.5,61.5 75,63 75,63.16 Q3.1
!GPIO_INT  (via drill 0.4)
  Top 0.25: v47.25,46.25 47.42,46.42 IC1.1 | v44.25,46.25 27.91,46.25 X1.SENSORS-7
  Bottom 0.25: v44.25,46.25 v47.25,46.25
+3V3  (via drill 0.4)
  Top 0.4: v63.5,67.5 62.5,68 | 71.9,64.4 72.5,65 | v78,66 78,67 | 83.5,61.5 84.5,61.5 | v86,51 87,51 | 65,50 v66,51 | v64.4,34.1 63.5,35 | v78,33.5 77,34.5 | v75,61 75,60.5 | 87.5,66 86.5,66
  Top 0.5: v13,19 14,20 14.5,20 | v60.25,12.75 59.25,12.75 | v3,41 2.75,41.25 2.75,44.5
  Top 0.6: v80.5,59 80,59 79.5,59.5
  Bottom 0.4: v63.5,67.5 63.6,67.5 | v86,51 84.15,49.15 R2.2 R1.2 | R3.2 68.1,48.9 v66,51 | R4.2 64.85,33.65 v64.4,34.1 | R5.2 80.6,33.4 R6.2 78.2,33.3 v78,33.5 | Q7.2 74.19,61 v75,61
  Bottom 0.5: R17.2 R16.2 R15.2 R14.2 R13.2 13,18.85 v13,19 | IC2.5 58.25,13.75 59.25,12.75 v60.25,12.75 | Q6.2 62.8,67.5 v63.5,67.5 | IC4.5 3.9,41 v3,41
  Bottom 0.6: Q5.2 82.3,57.2 v80.5,59
  Bottom 0.75: Q3.2 74.86,65.36 75.5,66 v78,66
  pour Top (isolate 0.254, rank 2): 0,0 95,0 95,90 0,90
+12V  (via drill 0.4, 0.6)
  Top 0.5: X15.1 10.25,68.25 10.5,68.5
  Top 1: X1.CAN-5 12.73,66.27 10.5,68.5 | v20,27.5 20,49.75 v24.5,54.25 | v24.5,62 24.5,71.5 | X6.1 66,55 76,65 76,79.3 X16.1 | v61.25,21.25 X17.1
  Top 2: X15.1 13.25,71.5 24.5,71.5 29,71.5 34.5,77 43.25,77 v52.25,86
  Bottom 1: IC3.3 20,31.6 C7.1 v20,27.5 | v24.5,54.25 v24.5,62 | 61.5,42.75 X5.1 | 61.5,42.75 61.5,49.5 65.5,53.5 66.5,53.5 66,53 X6.1 | X17.1 51,6.25 50.75,6 D1.CATHODE | v61.25,21.25 61.5,21.5 61.5,42.75
  Bottom 2: X16.1 71.2,80.8 66,86 v52.25,86
+12V_CAN
  Bottom 1: X12.1 28,6.25 29.75,4.5 40.75,4.5 42.5,6.25 X13.1
ALARM  (via drill 0.4)
  Top 0.25: IC1.19 50.67,56.33 49.5,57.5 18,57.5 v16.5,56
  Bottom 0.25: v16.5,56 15.95,55.45 Q9.1
BALANCE_ENABLE_RELAY
  Top 0.25: X1.X1-5 R25.2 45.25,28 45.35,28.1 R24.2 47.25,28.1 R23.2
BALANCE_LED_GREEN_CATHODE1
  Bottom 0.75: X9.2 R10.2 68.5,64
BALANCE_LED_YELLOW_CATHODE1
  Bottom 0.75: X9.1 66,65.5 64.5,64 R9.2
BALANCER_CLK  (via drill 0.4)
  Top 0.25: v50.5,34.5 51.25,34.5 52.75,33 52.75,30.75 54.25,29.25 57.25,29.25 71,15.5 77.75,15.5 79.75,13.5 X3.2 | v35.5,64.75 39.75,60.5 v42,60.5
  Bottom 0.25: R26.2 42.5,62.5 41.25,61.25 | 41.25,61.25 40.5,60.5 40.5,44.5 v50.5,34.5 | SV2.4 35.5,77.5 33.75,75.75 33.75,66.5 v35.5,64.75 | 41.25,61.25 v42,60.5
BALANCER_CS  (via drill 0.4)
  Top 0.25: v50.5,37.5 53,35 56.25,35 59,32.25 59,30 71.5,17.5 80.75,17.5 84.75,13.5 X3.4 | v39.25,67.25 45,61.5 v47.5,61.5
  Bottom 0.25: 46,61.5 46,60.5 42,56.5 42,45.75 v50.5,37.5 | 46,61.5 R28.2 | SV2.6 40.58,75.58 38.75,73.75 38.75,67.75 v39.25,67.25 | 46,61.5 v47.5,61.5
BALANCER_MISO  (via drill 0.4)
  Top 0.25: v50.75,36 53.5,33.25 53.5,31 54.5,30 57.75,30 71.25,16.5 79.25,16.5 82.25,13.5 X3.3 | v38,64.75 40.5,62.25 42.25,62.25 v43.25,61.25
  Bottom 0.25: 44.25,61.25 44.25,60.25 41.25,57.25 41.25,45 50.25,36 v50.75,36 | 44.25,61.25 R27.2 | SV2.5 38.04,64.79 v38,64.75 | 44.25,61.25 v43.25,61.25
BULK_CHARGE_ENABLE
  Bottom 0.25: R22.2 53,73.67 X1.X2-10 51.6,68.11 49.5,66 49.5,53.5 59.25,43.75 59.25,17.15 IC2.3
BULK_CHARGE_ENABLE_BUFFERED
  Bottom 0.5: IC2.4 62.85,14.4 X11.3
BULK_CHARGE_POWER_RELAY
  Bottom 0.25: R21.2 50.15,75.15 50.25,75.25 50.25,72.36 X1.X2-9 50.34,68.83 48.5,67 48.5,41 53.25,36.25 53.25,29.75 57.25,25.75 57.25,17.05 | 57.25,17.05 57.25,17 | IC2.1 57.25,17.05
BULK_CHARGER_POWER_RELAY_BUFFERED
  Bottom 0.5: IC2.6 57.3,13.2 59.75,10.75 X11.1
CANH
  Top 0.5: X13.4 40.75,13 29.75,13 X12.4
  Bottom 0.25: X1.CAN-6 27.73,66.27 32.75,61.25 32.75,19.5 28,14.75 X12.4 28.75,12
CANL
  Top 0.5: X13.5 38,9.75 26.5,9.75 X12.5
  Bottom 0.25: X1.CAN-4 28.73,64.27 32,61 32,20 25,13 X12.5
CHARGE_LED_YELLOW_CATHODE
  Bottom 0.75: X8.1 80.5,64 79.65,64 R7.2
ERROR_BUTTON
  Top 0.25: IC1.5 50.02,44.48 63,31.5 80.5,31.5 83,34 X4.2
  Bottom 0.5: X4.2 R5.1
ERROR_INDICATOR  (via drill 0.4)
  Top 0.25: IC1.4 49.38,43.62 62.75,30.25 v63.5,30.25
  Bottom 0.25: v63.5,30.25 86,30.5 87.5,32 87.5,33.3 Q4.1
ERROR_INDICATOR_CATHODE
  Bottom 0.8: Q4.3 86.5,36 85.5,37 X4.3
GND  (via drill 0.4)
  Top 0.25: SJ2.1 SJ1.1 | SJ3.1 SJ2.1 | SJ2.1 v52.5,64
  Top 0.3: IC1.12 55.7,49.2 v56.5,50
  Top 0.4: C1.2 45.35,53 v44,53
  Top 0.5: v30.75,48.25 31.25,48.75 v37.25,48.75 v43.75,48.75
  Bottom 0.25: v52.5,64 52,64
  Bottom 0.3: v56.5,50 56.5,50.5
  Bottom 0.4: v44,53 43.5,53.5
  Bottom 0.5: 57.5,51.25 57.75,51.5 58,51.5
  Bottom 3: 83.5,77 X16.2
  other vias: 19,87.25 20.5,84.75 22.25,87.25
  pour Bottom (isolate 0.254, rank 2): 0,0 95,0 95,90 0,90
  pour Top: 23.5,89 23.5,83.25 18,83.25 18,89
  pour Bottom (rank 2): 18,89 23.5,89 23.5,83.75 18,83.75
I2C_SCL  (via drill 0.4)
  Top 0.25: X1.X1-3 42.72,32.5 | v46.75,36.25 46.25,36.75 46.25,50.25 48.73,52.73 IC1.22 48.73,55.77 48,56.5 42.35,56.5 R12.1
  Bottom 0.25: 42.75,33.25 42.72,33.22 X1.X1-3 | 42.75,33.25 41.25,34.75 40.25,34.75 34.77,40.23 34.75,40.23 34.75,63 30.75,67 30.75,84.5 30.5,84.75 30.5,84.92 SV2.2 | v46.75,36.25 45.75,36.25 42.75,33.25
I2C_SDA
  Top 0.25: IC1.23 48.08,53.58 45.5,51 | 45.5,51 45.5,35.5 46.5,34.5 46.5,32.3 X1.X1-6 | 45.5,51 R11.1
  Bottom 0.25: X1.X1-6 46.5,32.24 46.5,31.25 45.75,30.5 39.5,30.5 38,32 38,35.25 33.75,39.5 34,62.5 28.25,68.25 28,84.88 SV2.1
LCD_DOWN_BUTTON
  Top 0.25: IC1.18 51.33,57.17 50,58.5 11.5,58.5 X10.2
LCD_POWER
  Bottom 0.25: IC3.2 22.85,35 R18.2
  Bottom 0.75: IC3.4 5.5,35 3.5,37 X2.1
  Bottom 1: C8.1 13.1,39.5 IC3.4 IC3.2 19.5,35
LCD_SERIAL_TX/BALANCER_MOSI  (via drill 0.4)
  Top 0.25: v40,36.75 40,36 37.75,33.75 37.75,29.25 v38.25,28.75 | v52.25,28.75 52.5,28.5 56.75,28.5 70.75,14.5 76.25,14.5 77.25,13.5 X3.1 | v19.5,56.5 v36,56.5
  Bottom 0.25: 39.75,56.5 39.75,37 v40,36.75 | 39.75,56.5 39.75,61 40.75,62 R20.2 40.6,62.5 36.5,62.5 32.96,66.04 SV2.3 | v38.25,28.75 v52.25,28.75 | IC4.2 6,45.75 13,52.75 15.75,52.75 v19.5,56.5 | v36,56.5 39.75,56.5
LCD_SERIAL_TX_ENABLE  (via drill 0.4)
  Top 0.25: X1.X2-3 42.72,70.22 41.5,69 30.5,69 26.5,65 26.5,62 25,60.5 v12.75,60.5
  Bottom 0.25: v12.75,60.5 11.5,59.25 11.5,52.75 5.05,46.3 IC4.1
LCD_UP_BUTTON
  Top 0.25: IC1.17 51.98,58.02 50.5,59.5 10,59.5 X10.1
MODE_SWITCH_CHARGE
  Top 0.25: IC1.9 52.62,47.38 54,46 78.5,46 80.5,48 X7.1
  Bottom 0.8: X7.1 R1.1
MODE_SWITCH_CHARGE_AND_BALANCE
  Top 0.25: IC1.8 51.98,47.02 54,45 80,45 83,48 X7.2
  Bottom 0.8: X7.2 R2.1
N$1
  Bottom 0.8: R6.1 X4.1 80.5,38.5
N$2
  Bottom 0.75: Q3.3 77.14,62.35 78,61.5 79.35,61.5 R7.1
N$3
  Bottom 0.6: Q5.3 83.25,61.1 R8.1
N$4
  Bottom 0.75: Q6.3 60.4,63.6 62.5,61.5 64.35,61.5 R9.1
N$5
  Bottom 0.75: Q7.3 70.75,62.75 69.5,61.5 68.65,61.5 R10.1
N$6
  Bottom 0.75: X8.2 83,64.65 R8.2
N$7
  Bottom 0.8: Q9.3 15,60.75 X15.2
N$8
  Bottom 0.25: X1.X2-2 41.45,66.19 40.75,65.5 R20.1
N$9
  Top 0.25: IC1.3 48.73,50.23 50.25,51.75 55.75,51.75 59.25,55.25 59.25,62.5 55.25,66.5 SJ1.2
N$10
  Bottom 0.25: IC3.1 22.7,37.3 23,37 | 23,37 R18.1 | 23,37 R19.2
N$11  (via drill 0.4)
  Top 0.25: IC1.2 48.08,50.58 50,52.5 55.5,52.5 58.25,55.25 58.25,62 55.5,64.75 v54,64.75 | v53.5,68.75 53.5,66.5 SJ2.2
  Bottom 0.25: v54,64.75 54,68.25 v53.5,68.75
N$12
  Top 0.25: IC1.21 49.38,53.62 49.75,53.25 55.25,53.25 57.25,55.25 57.25,61.5 55.75,63 51,63 48.75,65.25 48.75,66 49.25,66.5 SJ3.2
N$13
  Bottom 0.25: IC4.4 6.95,39.2 X2.2
N$14
  Bottom 0.25: X1.X2-5 45.26,68.25 42.5,65.5 R26.1
N$15
  Bottom 1: T1.C 54.79,12.29 X17.2 53.5,6 D1.ANODE
N$16
  Top 0.25: T1.B 52.25,24.5 50.35,26.4 R23.1 R24.1 R25.1
N$17
  Bottom 0.25: X1.X2-6 46.52,68.03 44.25,65.75 R27.1
N$18
  Bottom 0.25: X1.X2-7 47.8,67.8 46,66 R28.1
SHIELD
  Bottom 0.5: X12.3 23.55,9.8 34.95,9.8 X13.3
START_BUTTON
  Top 0.25: IC1.11 53.92,48.08 54,48 67,48 68.5,49.5 X6.2
  Bottom 0.4: X6.2 R3.1
START_INDICATOR  (via drill 0.4)
  Top 0.25: IC1.10 53.27,47.73 54,47 v64,47
  Bottom 0.25: v64,47 70.5,47 72,48.5 72,48.8 Q1.1
START_INDICATOR_CATHODE
  Bottom 0.8: Q1.3 X6.3 71,53.5
STOP_BUTTON
  Top 0.25: IC1.7 51.33,46.17 61.5,36 66.5,36 68.5,38
  Top 0.3: 68.5,38 X5.2
  Bottom 0.3: X5.2 R4.1
STOP_INDICATOR  (via drill 0.4)
  Top 0.25: IC1.6 50.67,45.33 v63,33
  Bottom 0.25: v63,33 63.5,32.5 71,32.5 72,33.5 72,33.8 Q2.1
STOP_INDICATOR_CATHODE
  Bottom 0.8: Q2.3 X5.3
TEMP-1
  Top 0.25: X14.6 17.5,12.5 31,26 31,36 29.73,37.27 X1.SENSORS-12
  Bottom 0.4: C2.1 12.7,13.5 X14.6 11.7,15.85 R13.1
TEMP-2
  Top 0.25: X14.7 11.2,14 17.5,14 29.39,25.89 X1.SENSORS-11
  Bottom 0.4: C3.1 16.05,11.45 16.25,11.25 10.95,11.25 X14.7 9.7,15.85 R14.1
TEMP-3
  Top 0.25: X14.8 10.2,15 17,15 28.25,26.25 28.25,42 29.39,43.14 X1.SENSORS-15
  Bottom 0.4: C4.1 16.05,9.95 16,10 10.2,10 X14.8 7.7,15.85 R15.1
TEMP-4  (via drill 0.4)
  Top 0.25: X14.9 9.2,16 16.5,16 25.5,25 25.5,43.5 26.25,44.25 28.25,44.25 29.27,45.27 X1.SENSORS-16
  Top 0.4: X14.9 7.2,11 12,11 v14,9
  Bottom 0.4: X14.9 5.7,15.85 R16.1 | v14,9 14,8.25 16,6.25 16,5.1 C5.1
TEMP-5  (via drill 0.4)
  Top 0.25: X14.10 8.2,17 16,17 24.5,25.5 24.5,49 25.75,50.25 28.25,50.25 29.27,51.27 X1.SENSORS-19
  Top 0.4: X14.10 6.2,10 11.5,10 15.5,6 15.5,4.75 14.75,4 12.5,4 v12.25,4.25
  Bottom 0.4: X14.10 3.7,15.85 R17.1 | v12.25,4.25 12.25,3.5 13.25,2.5 C6.1 16.25,2.5

### Text on the board
tPlace: I2C SDA | I2C SCL | MOSI/LCD SERIAL | SCLK | MISO | BALANCE CS | GND | +12V IN | GND | YELLOW | GREEN | GND | YELLOW | GREEN | GND | +12V | ALARM- | BAL IND | CHARGE IND | ALARM | UP | DOWN | GND | +12V | START BTN | START LED - | GND | CHARGE | CHARGE+BAL | GND | LCD BTNS | START | MODE | +V | DATA | GND | +12V | STOP BTN | STOP LED - | GND | ERR LED+ | ERR BUTTON | ERR LED- | GND | LCD | STOP | ERROR | E | B | C | 1 | 2 | 3 | 4 | 5 | +12V | RELAY- | CHARGER POWER | GND | CHG ENABLE | GND | MOSI | CLK | MISO | CS | BALANCE | BALANCE | THERMISTORS | CAN | CAN | RELAY | CHARGER | COMM
bPlace: Balancer Front Panel v1.0 | Aaron Bonnell-Kangas
tDocu: A0 | A1 | A2 | 1 | 0 | I2C ADDRESS